# EAGLE design Robotics lure (EAGLE 7.6.0)
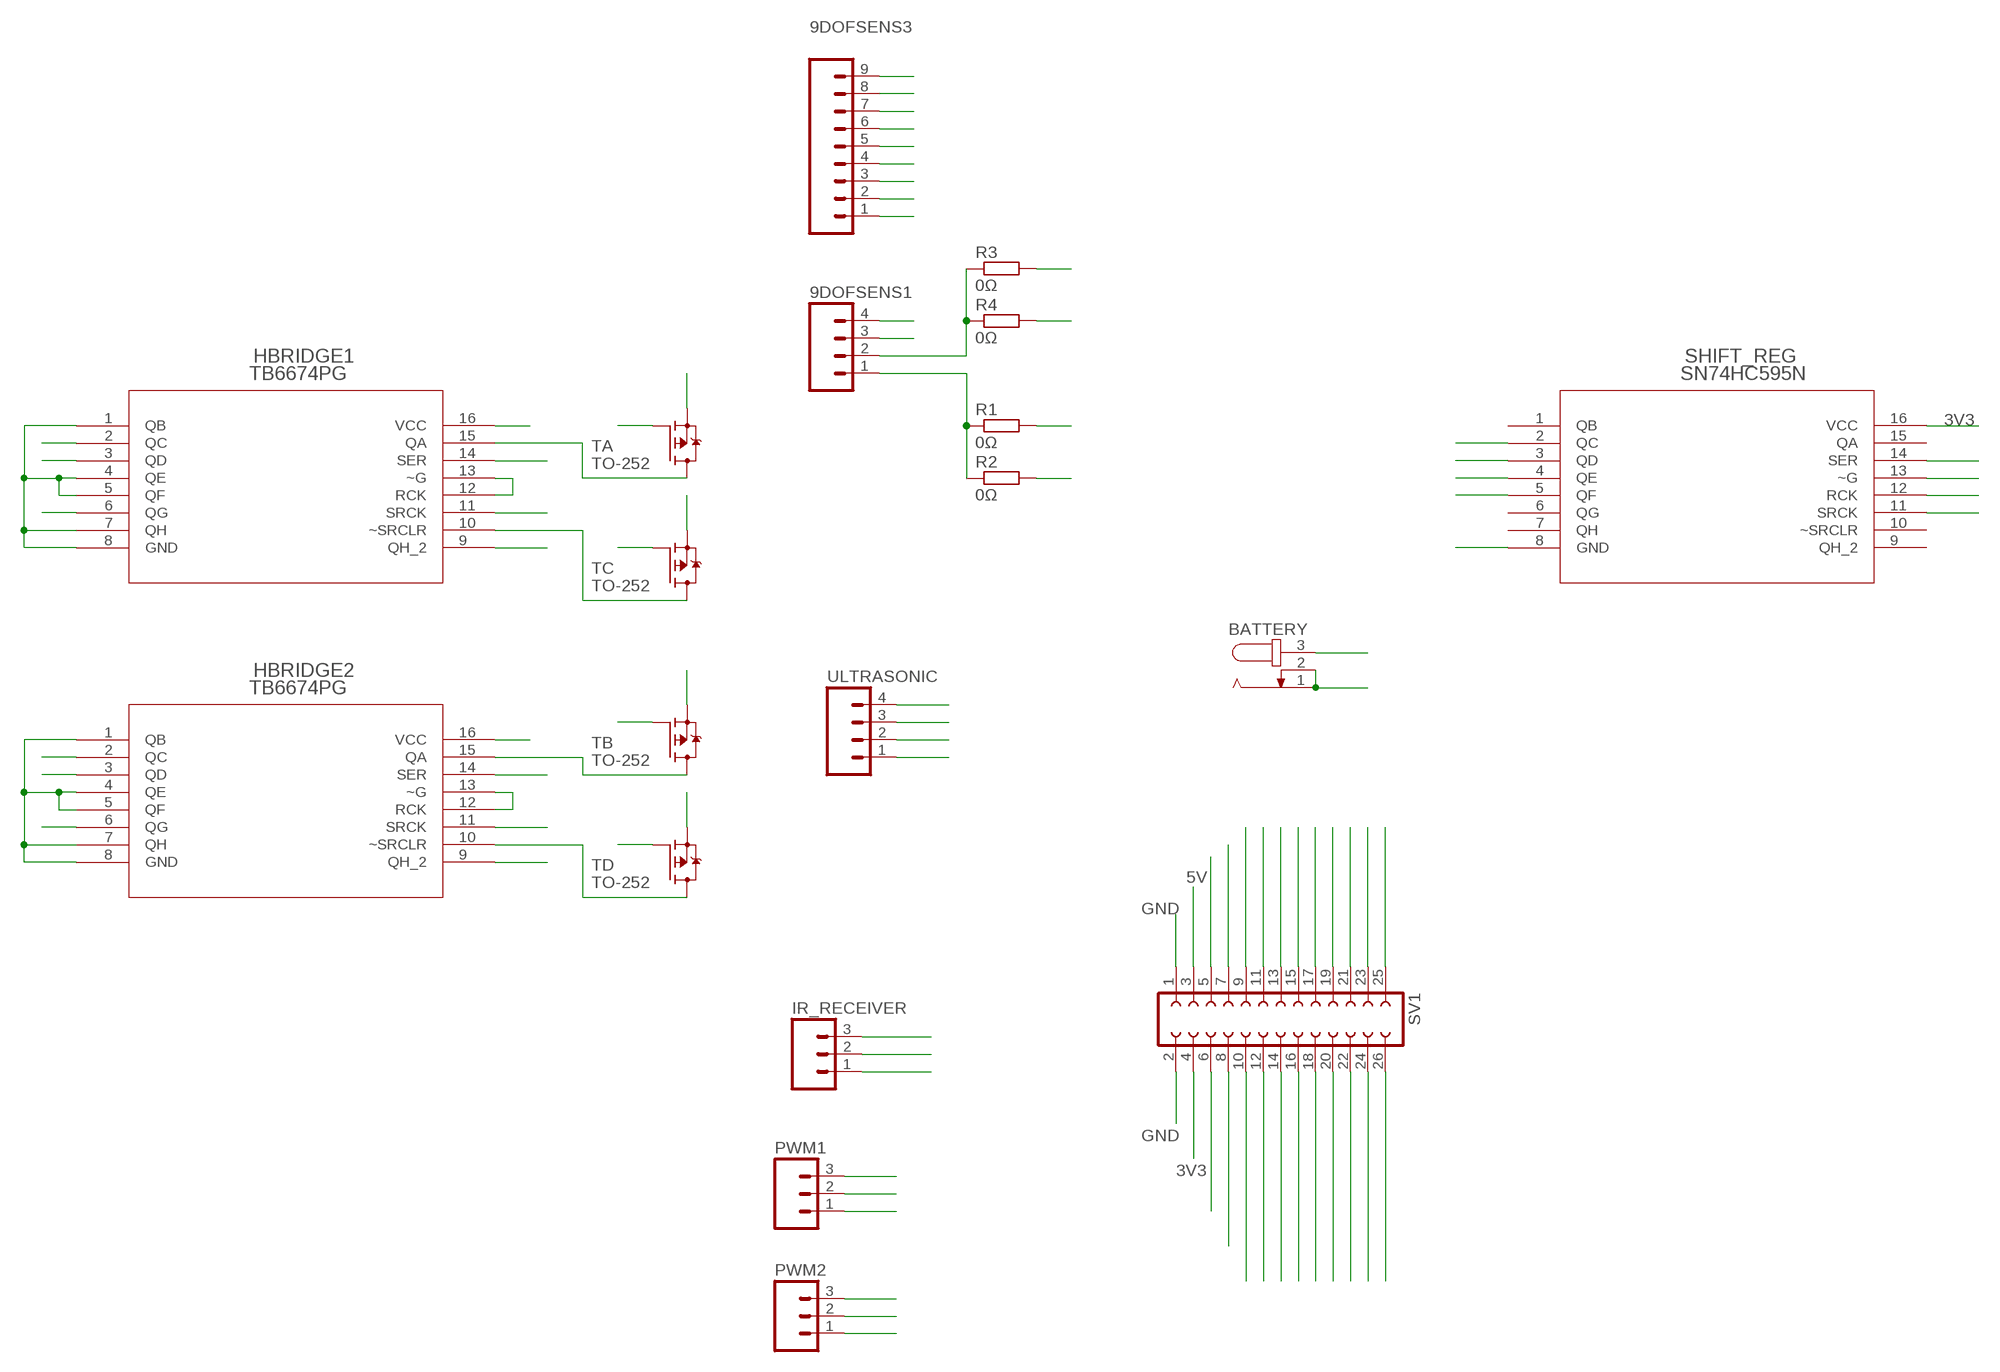
[diagram p0: schematic, sheet 1]

## Parts
9DOFSENS1  M04PTH  [1X04]
9DOFSENS3  M09  [1X09]
BATTERY  JACK-PLUG0  [SPC4077]
HBRIDGE1  TB6674PG  SN74HC595N  [DIP16_300]
HBRIDGE2  TB6674PG  SN74HC595N  [DIP16_300]
IR_RECEIVER  M03PTH  [1X03]
PWM1  M03PTH  [1X03]
PWM2  M03PTH  [1X03]
R1  0Ω  R-EU_R1206  [R1206]
R2  0Ω  R-EU_R1206  [R1206]
R3  0Ω  R-EU_R1206  [R1206]
R4  0Ω  R-EU_R1206  [R1206]
SHIFT_REG  SN74HC595N  [DIP16_300]
SV1  FE13-2W  [FE13-2W]
TA  TO-252  SPD30P06PTO252  [TO252]
TB  TO-252  SPD30P06PTO252  [TO252]
TC  TO-252  SPD30P06PTO252  [TO252]
TD  TO-252  SPD30P06PTO252  [TO252]
ULTRASONIC  M04PTH  [1X04]

## Nets
3V3: 9DOFSENS1.3 IR_RECEIVER.1 SHIFT_REG.16(VCC) SV1.4
5V: HBRIDGE1.2(QC) HBRIDGE2.2(QC) PWM1.2 PWM2.2 SV1.3 ULTRASONIC.1
14V: BATTERY.3 HBRIDGE1.9(QH_2) HBRIDGE1.16(VCC) HBRIDGE2.9(QH_2) HBRIDGE2.16(VCC)
GND: 9DOFSENS1.4 BATTERY.1 BATTERY.2 HBRIDGE1.1(QB) HBRIDGE1.4(QE) HBRIDGE1.5(QF) HBRIDGE1.7(QH) HBRIDGE1.8(GND) HBRIDGE1.12(RCK) HBRIDGE1.13(~G) HBRIDGE2.1(QB) HBRIDGE2.4(QE) HBRIDGE2.5(QF) HBRIDGE2.7(QH) HBRIDGE2.8(GND) HBRIDGE2.12(RCK) HBRIDGE2.13(~G) IR_RECEIVER.2 PWM1.1 PWM2.1 SHIFT_REG.8(GND) SV1.1 SV1.2 ULTRASONIC.4
GPIO_I2C_SCL_(I2C#5): R1.2 SV1.13
GPIO_I2C_SDA_(I2C_#5): R3.2 SV1.15
GPIO_I2S_CLK: 9DOFSENS3.1 SV1.14
GPIO_I2S_DI: 9DOFSENS3.3 9DOFSENS3.8 SV1.20
GPIO_I2S_DO: 9DOFSENS3.5 SV1.18
GPIO_I2S_FRM: SV1.16
GPIO_PWM0: PWM1.3 SV1.22
GPIO_PWM1: PWM2.3 SV1.24
GPIO_S5_0: SHIFT_REG.14(SER) SV1.21
GPIO_S5_1: SHIFT_REG.13(~G) SV1.23
GPIO_S5_2: SHIFT_REG.12(RCK) SV1.25
GPIO_SPI_CLK: R4.2 SV1.11
GPIO_SPI_CS#: SV1.5 ULTRASONIC.2
GPIO_SPI_MISO: 9DOFSENS3.9 SV1.7
GPIO_SPI_MOSI: R2.2 SV1.9
GPIO_UART1_CTS: 9DOFSENS3.7 SV1.10
GPIO_UART1_RTS: 9DOFSENS3.6 SV1.12
GPIO_UART1_RXD: IR_RECEIVER.3 SV1.8
GPIO_UART1_TXD: SV1.6 ULTRASONIC.3
GPIO_UART2_RXD: 9DOFSENS3.2 SV1.19
GPIO_UART2_TXD: 9DOFSENS3.4 SV1.17
I2SMCLK_GPIO: SHIFT_REG.11(SRCK) SV1.26
MOTA+: TA.2(S)
MOTA-: HBRIDGE1.14(SER)
MOTACTRL: HBRIDGE1.3(QD) SHIFT_REG.2(QC) TA.1(G)
MOTB+: TB.2(S)
MOTB-: HBRIDGE1.11(SRCK)
MOTBCTRL: HBRIDGE2.3(QD) SHIFT_REG.3(QD) TB.1(G)
MOTC+: TC.2(S)
MOTC-: HBRIDGE2.14(SER)
MOTCCTRL: HBRIDGE1.6(QG) SHIFT_REG.4(QE) TC.1(G)
MOTD+: TD.2(S)
MOTD-: HBRIDGE2.11(SRCK)
MOTDCTRL: HBRIDGE2.6(QG) SHIFT_REG.5(QF) TD.1(G)
N$2: HBRIDGE2.15(QA) TB.3(D)
N$3: HBRIDGE2.10(~SRCLR) TD.3(D)
N$4: HBRIDGE1.10(~SRCLR) TC.3(D)
N$5: HBRIDGE1.15(QA) TA.3(D)
SCL: 9DOFSENS1.1 R1.1 R2.1
SDA: 9DOFSENS1.2 R3.1 R4.1
Unconnected: SHIFT_REG.1(QB) SHIFT_REG.6(QG) SHIFT_REG.7(QH) SHIFT_REG.9(QH_2) SHIFT_REG.10(~SRCLR) SHIFT_REG.15(QA)

## Library data of the parts
9DOFSENS1 ULTRASONIC = SparkFun-Connectors:M04: Header 4 Standard 4-pin 0.1" header. Use with straight break away headers (SKU : PRT-00116), right angle break away headers (PRT-00553), swiss pins (PRT-00743), machine pins (PRT-00117), and female headers (PRT-00115). Molex polarized connector foot print use with SKU : PRT-08231 with associated crimp pins and housings. 1MM SMD Version SKU: PRT-10208; PROD_ID: CONN-09696
9DOFSENS3 = SparkFun-Connectors:M09: Header 9 Standard 9-pin 0.1" header. Use with straight break away headers (SKU : PRT-00116), right angle break away headers (PRT-00553), swiss pins (PRT-00743), machine pins (PRT-00117), and female headers (PRT-00115).
BATTERY = con-jack:JACK-PLUG: DC POWER JACK Power Jack, DC, Right Angle, Through Hole, Rated 5A at 16VDC, PC Terminals Distributor: Farnell (www.Farnell.de) Drawing: 84N1161.pdf / 84N1162.pdf Manufacturer: SPC Technology (www.spctechnology.com) Type: SPC4077 / SPC 4078; OC_FARNELL: unknown; OC_NEWARK: unknown
HBRIDGE1 HBRIDGE2 SHIFT_REG = Shift Reg:SN74HC595N; COPYRIGHT: Copyright (C) 2015 Accelerated Designs. All rights reserved; DATABASE: INTEGRATEDCIRCUITS; DATASHEET: http://www.ti.com/lit/ds/symlink/sn74hc595.pdf; DIGIKEYPARTNUMBER: 296-1600-5-ND; FOOTPRINT_NAME: DIP16; FUNCTION: Serial to Parallel; ID: 200124; LOGICTYPE: Shift Register; MANUFACTURER_PART_NUMBER: SN74HC595N; MOUNTINGTYPE: Through Hole; NUMBEROFBITSPERELEMENT: 8; NUMBEROFELEMENTS: 1; OPERATINGTEMPERATURE: -40°C ~ 85°C; OUTPUTTYPE: Tri-State; PACKAGING: Tube; QUANTITY_AVAILABLE: 5099; SERIES: 74HC; SUPPLIERDEVICEPACKAGE: 16-PDIP; VENDOR: Texas Instruments; VOLTAGE-SUPPLY: 2 V ~ 6 V
IR_RECEIVER PWM1 PWM2 = SparkFun-Connectors:M03: Header 3 Standard 3-pin 0.1" header. Use with straight break away headers (SKU : PRT-00116), right angle break away headers (PRT-00553), swiss pins (PRT-00743), machine pins (PRT-00117), and female headers (PRT-00115). Molex polarized connector foot print use with SKU : PRT-08232 with associated crimp pins and housings.
R1-R4 = rcl:R-EU_: RESISTOR, European symbol
SV1 = con-lsta:FE13-2W: FEMALE HEADER; OC_FARNELL: unknown; OC_NEWARK: unknown
TA TB TC TD = transistor-fet:SPD30P06P: SIPMOS(R) Power-Transistor P-Channel, Enhancement mode Source: http://www.infineon.com/upload/Document/cmc_upload/documents/012/3615/SPD_U30P06P.pdf

## Board
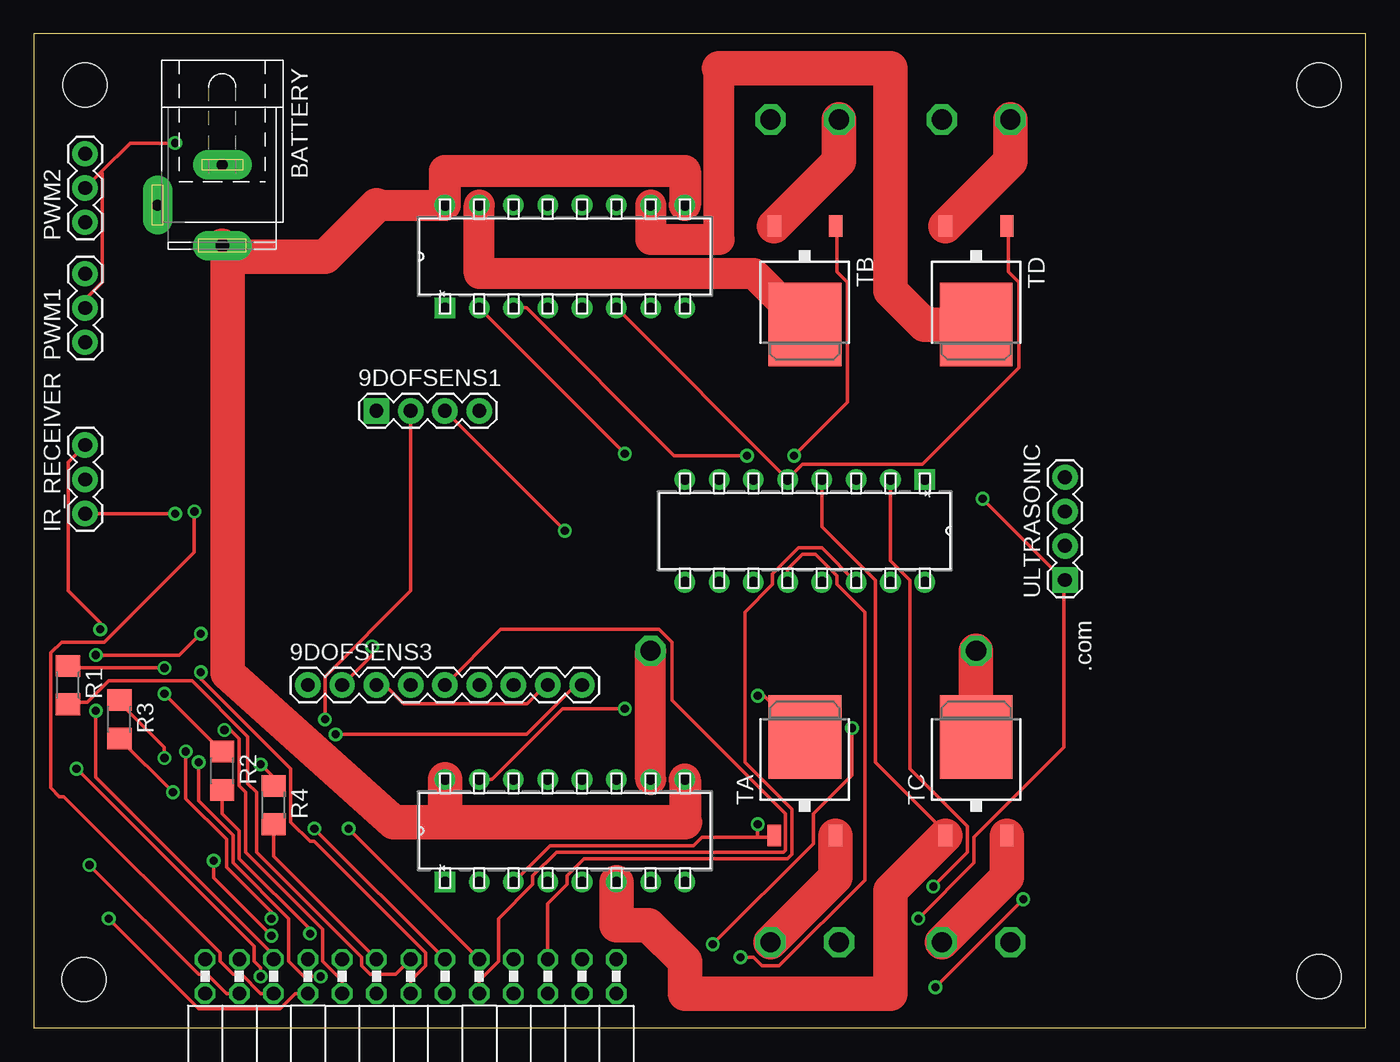
[diagram p1: board, top side]
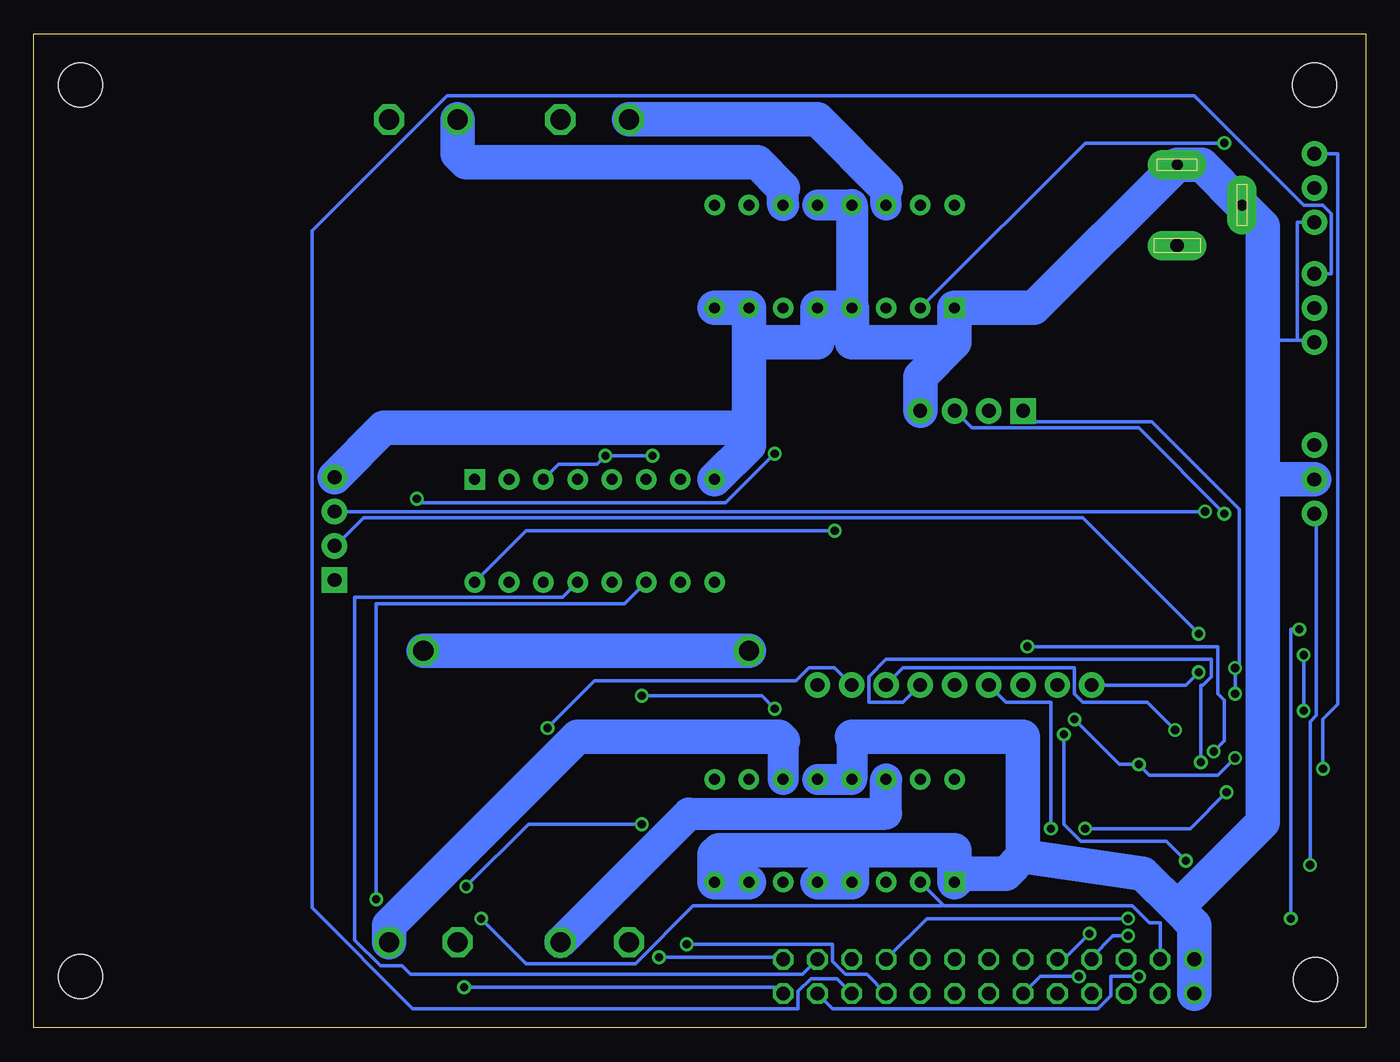
[diagram p2: board, bottom side, seen from below]

Size 98.73 x 73.65 mm. Coordinates in mm from the lower left corner, seen from the top.
Outline: 0,0 98.73,0 98.73,73.65 0,73.65 0,0
Copper layers (1*16): Top 0.035mm / dielectric 1.5mm / Bottom 0.035mm
Design rules "default": minimum track width 10mil, minimum drill 24mil, track to track 8mil, track to pad 8mil, pad to pad 8mil, via to via 8mil, smd to smd 8mil, copper to edge 40mil, drill to drill 8mil, minimum pad ring 10mil, minimum via ring 8mil, stop-mask expansion 4mil, vias tented up to drill 0mil, thermal gap 10mil
Holes 3.28 mm at 3.71,3.58 95.25,3.81 95.25,69.85 3.81,69.85

### Footprints (pad centres in the part's own frame; a part is rotated, then mirrored left to right if it is on the bottom)
1X04 = drill 1.016 pad 1.88 square: 1 0,0 | drill 1.016 pad 1.88: 2 2.54,0; 3 5.08,0; 4 7.62,0
1X09 = drill 1.016 pad 1.88: 1 0,0; 2 2.54,0; 3 5.08,0; 4 7.62,0; 5 10.16,0; 6 12.7,0; 7 15.24,0; 8 17.78,0; 9 20.32,0
SPC4077 = drill 0.8 pad 2.184 long: 1 -3,0; 2 0,-4.8 | drill 1 pad 2.184 long: 3 3,0
DIP16_300 = drill 0.813 pad 1.524 square: 1 -7.62,17.78 | drill 0.813 pad 1.524: 2 -7.62,15.24; 3 -7.62,12.7; 4 -7.62,10.16; 5 -7.62,7.62; 6 -7.62,5.08; 7 -7.62,2.54; 8 -7.62,0; 9 0,0; 10 0,2.54; 11 0,5.08; 12 0,7.62; 13 0,10.16; 14 0,12.7; 15 0,15.24; 16 0,17.78
1X03 = drill 1.016 pad 1.88: 1 0,0; 2 2.54,0; 3 5.08,0
R1206 = smd 1.6 x 1.803: 1 -1.422,0; 2 1.422,0
FE13-2W = drill 1.016 octagon: 1 -15.24,1.27; 2 -15.24,-1.27; 3 -12.7,1.27; 4 -12.7,-1.27; 5 -10.16,1.27; 6 -10.16,-1.27; 7 -7.62,1.27; 8 -7.62,-1.27; 9 -5.08,1.27; 10 -5.08,-1.27; 11 -2.54,1.27; 12 -2.54,-1.27; 13 0,1.27; 14 0,-1.27; 15 2.54,1.27; 16 2.54,-1.27; 17 5.08,1.27; 18 5.08,-1.27; 19 7.62,1.27; 20 7.62,-1.27; 21 10.16,1.27; 22 10.16,-1.27; 23 12.7,1.27; 24 12.7,-1.27; 25 15.24,1.27; 26 15.24,-1.27
TO252 = smd 1 x 1.6: 1 -2.28,-4.8; 2 2.28,-4.8 | smd 5.4 x 6.2: 3 0,2.5

### Placement (x,y rotation side)
9DOFSENS1  25.4,45.72 0 top
9DOFSENS3  20.32,25.4 0 top
BATTERY  13.97,60.96 270 top
HBRIDGE1  48.26,18.41 90 top
HBRIDGE2  48.26,60.96 90 top
IR_RECEIVER  3.81,38.1 90 top
PWM1  3.81,50.8 90 top
PWM2  3.81,59.69 90 top
R1  2.54,25.4 270 top
R2  13.97,19.05 270 top
R3  6.35,22.86 270 top
R4  17.78,16.51 270 top
SHIFT_REG  48.26,33.02 270 top
SV1  27.94,3.81 0 top
TA  57.15,19.05 0 top
TB  57.15,54.61 180 top
TC  69.85,19.05 0 top
TD  69.85,54.61 180 top
ULTRASONIC  76.43,33.18 90 top

### Tracks (layer width: path | path; a pad name or v marks a point on that pad's centre or on a via)
3V3  (via drill 0.61)
  Top 0.254: SV1.4 14.29,2.54 12.86,3.97 12.22,3.97 v4.13,12.06 | 9DOFSENS1.3 v39.37,36.83 | v10.48,38.1 IR_RECEIVER.1
  Bottom 0.254: v4.13,12.06 4.13,22.7 3.65,23.18 3.65,38.1 IR_RECEIVER.1 | SHIFT_REG.16 62.23,36.83 v39.37,36.83 | v10.48,38.1 16.83,44.45 29.21,44.45 9DOFSENS1.3
5V  (via drill 0.61)
  Top 0.254: v10.48,65.56 7.14,65.56 5,63.42 | PWM2.2 5,63.42 | PWM1.2 3.81,53.98 5.08,55.24 5.08,63.34 5,63.42 | 76.36,33.18 76.36,20.8 69.69,14.13 69.69,12.22 v65.56,8.1 | v43.81,42.55 HBRIDGE2.2 | 76.36,33.18 v70.33,39.21 | 76.36,33.18 ULTRASONIC.1
  Bottom 0.254: HBRIDGE2.2 20.8,65.56 v10.48,65.56 | SV1.3 15.24,7.78 16.03,7.78 17.3,9.05 31.27,9.05 31.35,9.13 | HBRIDGE1.2 31.35,9.13 | v65.56,8.1 62.23,4.76 54.13,4.76 49.85,9.05 31.43,9.05 31.35,9.13 | v43.81,42.55 47.47,38.89 70.01,38.89 v70.33,39.21
14V
  Top 2.286: 25.4,60.96 HBRIDGE2.16
  Top 2.362: HBRIDGE1.9 48.26,15.24 | HBRIDGE2.16 30.48,63.5 48.26,63.5 HBRIDGE2.9
  Top 2.54: BATTERY.3 14.38,57.55 | 14.38,57.55 14.78,57.15 21.59,57.15 25.4,60.96 | 14.38,57.55 14.38,26.27 26.67,15.24 30.48,15.24 | 30.48,15.24 HBRIDGE1.16 | 48.26,15.24 30.48,15.24
GND
  Bottom 0.254: 3.89,50.98 PWM1.1 3.97,50.96 5.08,50.96 | 3.89,59.66 PWM2.1 5.08,59.69 5.08,50.96 | 7.62,50.96 5.08,50.96
  Bottom 2.286: 38.1,21.59 HBRIDGE1.13 HBRIDGE1.12 | HBRIDGE2.13 HBRIDGE2.12
  Bottom 2.362: HBRIDGE2.13 HBRIDGE2.4
  Bottom 2.54: 30.48,50.8 HBRIDGE2.1 24.59,53.34 BATTERY.1 12.17,63.96 BATTERY.2 7.62,59.41 7.62,50.96 7.62,40.64 | 30.48,50.8 38.1,50.8 HBRIDGE2.4 HBRIDGE2.5 40.64,50.8 45.72,50.8 | HBRIDGE2.8 HBRIDGE2.7 45.72,50.8 | SHIFT_REG.8 45.72,43.18 45.72,44.45 | 45.72,44.45 45.72,50.8 | 38.1,13.18 47.94,13.18 48.26,12.86 HBRIDGE1.8 HBRIDGE1.7 | 38.1,13.18 HBRIDGE1.4 HBRIDGE1.5 | 25.4,12.7 26.67,11.43 29.84,11.43 HBRIDGE1.1 30.48,13.18 38.1,13.18 | 25.4,12.7 25.4,21.59 38.1,21.59 | 13.97,8.89 12.7,7.62 SV1.1 SV1.2 | 13.97,8.89 16.51,11.43 25.4,12.7 | 7.62,40.64 7.62,15.24 13.97,8.89 | ULTRASONIC.4 72.78,44.45 45.72,44.45 | 30.48,50.8 33.02,48.26 9DOFSENS1.4 | IR_RECEIVER.2 7.62,40.64
GPIO_I2C_SCL_(I2C#5)
  Top 0.254: SV1.13 26.83,3.97 24.92,3.97 24.29,4.6 24.29,5.24 16.51,13.02 16.51,17.46 15.88,18.1 15.88,21.59 11.75,25.72 5.56,25.72 3.97,24.13 2.54,24.13 R1.2
GPIO_I2C_SDA_(I2C_#5)  (via drill 0.61)
  Top 0.254: v10.32,17.46 R3.2 | SV1.15 v20.8,14.76
  Bottom 0.254: v10.32,17.46 13.02,14.76 v20.8,14.76
GPIO_I2S_CLK  (via drill 0.61)
  Top 0.254: SV1.14 27.94,3.49 29.05,4.6 29.05,5.56 20.8,13.81 20.48,13.81 19.05,15.24 19.05,19.21 12.38,25.88 v12.38,26.35
  Bottom 0.254: v12.38,26.35 13.34,25.4 9DOFSENS3.1
GPIO_I2S_DI  (via drill 0.61)
  Top 0.254: 9DOFSENS3.3 25.6,25.38 26.06,25.38 27.43,24 36.58,24 37.95,25.38 9DOFSENS3.8 | v50.32,6.19 57.78,13.65 57.78,15.88 60.64,18.73 v60.64,22.23
  Bottom 0.254: SV1.20 36.99,3.97 38.58,3.97 39.53,4.92 39.53,6.19 v50.32,6.19 | v60.64,22.23 57.15,25.72 42.23,25.72 41.27,26.67 39.37,26.67 9DOFSENS3.8
GPIO_I2S_DO
  Top 0.254: SV1.18 33.02,3.49 34.45,4.92 34.45,8.1 36.99,10.64 36.99,11.27 38.73,13.02 55.56,13.02 55.72,13.18 55.72,15.88 47.31,24.29 47.31,28.57 46.35,29.53 34.61,29.53 9DOFSENS3.5
GPIO_PWM0
  Bottom 0.254: SV1.22 39.21,3.65 41.12,3.65 42.07,2.7 42.07,1.43 70.64,1.43 78.11,8.89 78.11,59.05 68.1,69.06 12.7,69.06 4.6,60.96 3.17,60.96 2.54,60.33 2.54,55.88 PWM1.3
GPIO_PWM1  (via drill 0.61)
  Top 0.254: v16.83,3.81 16.83,4.45 16.35,4.92 16.35,6.03 v3.17,19.21
  Bottom 0.254: SV1.24 39.53,1.43 19.84,1.43 18.89,2.38 18.89,3.81 v16.83,3.81 | v3.17,19.21 3.17,22.86 2.06,23.97 2.06,64.77 PWM2.3
GPIO_S5_0
  Top 0.254: SV1.21 38.1,9.21 39.53,10.64 39.53,11.27 40.8,12.54 55.88,12.54 56.2,12.86 56.2,16.19 52.7,19.68 52.7,30.8 54.77,32.86 54.77,33.66 56.67,35.56 58.42,35.56 SHIFT_REG.14
GPIO_S5_1
  Bottom 0.254: SV1.23 41.75,3.97 70.8,3.97 71.44,4.6 73.03,4.6 74.93,6.51 74.93,31.91 59.53,31.91 SHIFT_REG.13
GPIO_S5_2  (via drill 0.61)
  Top 0.254: v52.39,5.24 53.34,5.24 53.98,4.6 55.24,4.6 61.59,10.95 61.59,30.8 59.53,32.86 59.53,33.5 57.94,35.08 56.99,35.08 55.88,33.97 SHIFT_REG.12
  Bottom 0.254: SV1.25 43.34,5.24 v52.39,5.24
GPIO_SPI_CLK
  Top 0.254: R4.2 17.78,12.7 SV1.11
GPIO_SPI_CS#  (via drill 0.61)
  Top 0.254: SV1.5 17.78,5.4 4.6,18.57 v4.6,23.5 | v4.6,27.62 10.79,27.62 v12.38,29.21
  Bottom 0.254: v4.6,27.62 v4.6,23.5 | v12.38,29.21 20.95,37.78 74.3,37.78 76.36,35.72 ULTRASONIC.2
GPIO_SPI_MISO  (via drill 0.61)
  Top 0.254: v17.62,6.83 13.34,11.11 v13.34,12.38 | v22.38,21.75 36.51,21.75 40.16,25.4 9DOFSENS3.9
  Bottom 0.254: 20.34,5.26 SV1.7 20.32,5.24 18.73,6.83 v17.62,6.83 | v13.34,12.38 14.76,13.81 21.11,13.81 22.38,15.08 v22.38,21.75
GPIO_SPI_MOSI  (via drill 0.61)
  Top 0.254: R2.2 13.97,15.88 15.24,14.61 15.24,12.54 20.48,7.3 v20.48,6.99
  Bottom 0.254: v20.48,6.99 22.38,5.08 SV1.9
GPIO_UART1_CTS  (via drill 0.61)
  Top 0.254: SV1.10 22.86,3.49 21.43,4.92 21.43,7.3 15.72,13.02 15.72,17.46 15.24,17.94 15.24,21.43 14.61,22.07 v14.13,22.07
  Bottom 0.254: v14.13,22.07 16.19,24.13 20.95,24.13 21.59,24.77 21.59,26.67 34.29,26.67 9DOFSENS3.7
GPIO_UART1_RTS  (via drill 0.61)
  Top 0.254: v21.27,3.81 20,3.81 18.89,4.92 18.89,8.1 14.76,12.22 14.76,14.29 12.22,16.83 v12.22,19.68
  Bottom 0.254: SV1.12 24.13,3.81 v21.27,3.81 | v12.22,19.68 12.22,25.4 12.06,25.4 11.43,26.04 11.43,27.3 35.56,27.3 36.83,26.04 36.83,24.13 34.29,24.13 9DOFSENS3.6
GPIO_UART1_RXD  (via drill 0.61)
  Top 0.254: SV1.8 19.37,2.54 18.26,1.43 12.22,1.43 v5.56,8.1 | v4.92,29.53 4.92,30 2.54,32.38 2.54,41.91 IR_RECEIVER.3
  Bottom 0.254: v5.56,8.1 5.56,29.53 v4.92,29.53
GPIO_UART1_TXD  (via drill 0.61)
  Top 0.254: SV1.6 16.83,2.54 15.4,3.97 14.76,3.97 13.81,4.92 13.81,5.56 2.22,17.14 1.91,17.14 1.27,17.78 1.27,27.78 2.06,28.57 5.24,28.57 11.91,35.24 v11.91,38.26
  Bottom 0.254: ULTRASONIC.3 v11.91,38.26
GPIO_UART2_RXD  (via drill 0.61)
  Top 0.254: v17.62,8.1 17.62,8.57 14.29,11.91 14.29,13.97 11.27,16.99 v11.27,20.48 | v25.08,28.26 25.08,27.62 9DOFSENS3.2
  Bottom 0.254: SV1.19 32.54,8.1 v17.62,8.1 | v11.27,20.48 10.48,21.27 10.48,24.29 10.95,24.77 10.95,28.26 v25.08,28.26
GPIO_UART2_TXD  (via drill 0.61)
  Top 0.254: v23.34,14.76 SV1.17
  Bottom 0.254: v23.34,14.76 23.34,24.13 26.67,24.13 9DOFSENS3.4
I2SMCLK_GPIO  (via drill 0.61)
  Top 0.254: v73.34,9.53 v66.83,3.02
  Bottom 0.254: SV1.26 43.66,3.02 v66.83,3.02 | v73.34,9.53 73.34,31.43 54.93,31.43 SHIFT_REG.11
MOTA+  (via drill 1.5)
  Top 2.54: v54.61,6.35 59.43,11.17 TA.2
MOTA-  (via drill 1.5)
  Bottom 2.362: v59.69,6.35 50.16,15.88 35.56,15.88 HBRIDGE1.14
MOTACTRL  (via drill 0.61)
  Top 0.254: 53.66,14.13 49.53,14.13 48.9,13.49 38.26,13.49 HBRIDGE1.3 | 53.66,14.13 54.77,14.13 TA.1 | SHIFT_REG.2 63.5,34.61 64.93,33.18 64.93,19.21 69.22,14.92 69.22,13.02 v66.67,10.48 | 53.66,14.13 v53.66,15.08
  Bottom 0.254: v66.67,10.48 62.07,15.08 v53.66,15.08
MOTB+  (via drill 1.5)
  Top 2.54: TB.2 59.69,64.23 v59.69,67.31
MOTB-  (via drill 1.5)
  Bottom 2.286: 43.18,21.27 HBRIDGE1.11
  Bottom 2.54: 43.18,21.27 43.5,21.59 58.42,21.59 72.39,7.62 v72.39,6.35
MOTBCTRL  (via drill 0.61)
  Top 0.254: v56.36,42.39 60.33,46.35 60.33,55.24 59.53,56.04 59.53,59.37 TB.1 | HBRIDGE2.3 36.51,53.34 47.47,42.39 v52.86,42.39
  Bottom 0.254: SHIFT_REG.3 59.85,41.75 56.99,41.75 v56.36,42.39 v52.86,42.39
MOTC+  (via drill 1.5)
  Top 2.54: v67.31,6.35 72.13,11.17 TC.2
MOTC-  (via drill 1.5)
  Bottom 2.286: HBRIDGE2.14 35.56,62.23
  Bottom 2.54: 35.56,62.23 40.64,67.31 v54.61,67.31
MOTCCTRL
  Top 0.254: SHIFT_REG.4 58.42,37.15 62.39,33.18 62.39,19.68 66.83,15.24 TC.1
  Top 2.54: TC.1 63.5,10.18 63.5,2.54 48.26,2.54 48.26,4.92 45.56,7.62 43.18,7.62 HBRIDGE1.6
MOTD+  (via drill 1.5)
  Top 2.54: TD.2 72.39,64.23 v72.39,67.31
MOTD-  (via drill 1.5)
  Bottom 2.388: HBRIDGE2.11 43.18,62.23
  Bottom 2.54: 43.18,62.23 45.09,64.14 66.67,64.14 67.31,64.77 v67.31,67.31
MOTDCTRL
  Top 0.254: TD.1 72.23,59.37 72.23,56.04 73.03,55.24 73.03,48.9 65.88,41.75 56.99,41.75 SHIFT_REG.5 HBRIDGE2.6
N$2
  Top 2.286: TB.3 53.38,55.88 33.02,55.88 HBRIDGE2.15
N$3
  Top 2.286: HBRIDGE2.10 45.72,58.42 50.8,58.42 50.8,71.12
  Top 2.54: 50.8,71.12 63.5,71.12 63.5,54.61 66,52.11 TD.3
N$4  (via drill 1.5)
  Top 2.286: HBRIDGE1.10 v45.72,27.94
  Top 2.54: TC.3 v69.85,27.94
  Bottom 2.54: v69.85,27.94 v45.72,27.94
N$5  (via drill 0.61)
  Top 0.254: HBRIDGE1.15 33.97,18.41 39.21,23.65 v43.81,23.65 | v53.66,24.61 54.13,24.61 57.15,21.59 TA.3
  Bottom 0.254: v43.81,23.65 44.77,24.61 v53.66,24.61
SCL  (via drill 0.61)
  Top 0.254: 2.52,26.75 R1.1 2.54,26.67 v9.68,26.67 | v9.68,24.77 R2.1
  Bottom 0.254: v9.68,24.77 v9.68,26.67 9.37,26.67 9.37,38.42 15.88,44.93 24.61,44.93 9DOFSENS1.1
SDA  (via drill 0.61)
  Top 0.254: R4.1 17.78,18.57 v16.83,19.53 | v9.68,20 9.68,20.8 6.35,24.13 R3.1 | 9DOFSENS1.2 27.94,32.38 21.59,26.04 v21.59,22.86
  Bottom 0.254: v9.68,20 10.95,18.73 16.03,18.73 v16.83,19.53 18.26,19.53 v21.59,22.86

### Text on the board
tPlace: .com